# EAGLE design crz7shld (EAGLE 9.6.2)

## Sheet 1 of 2
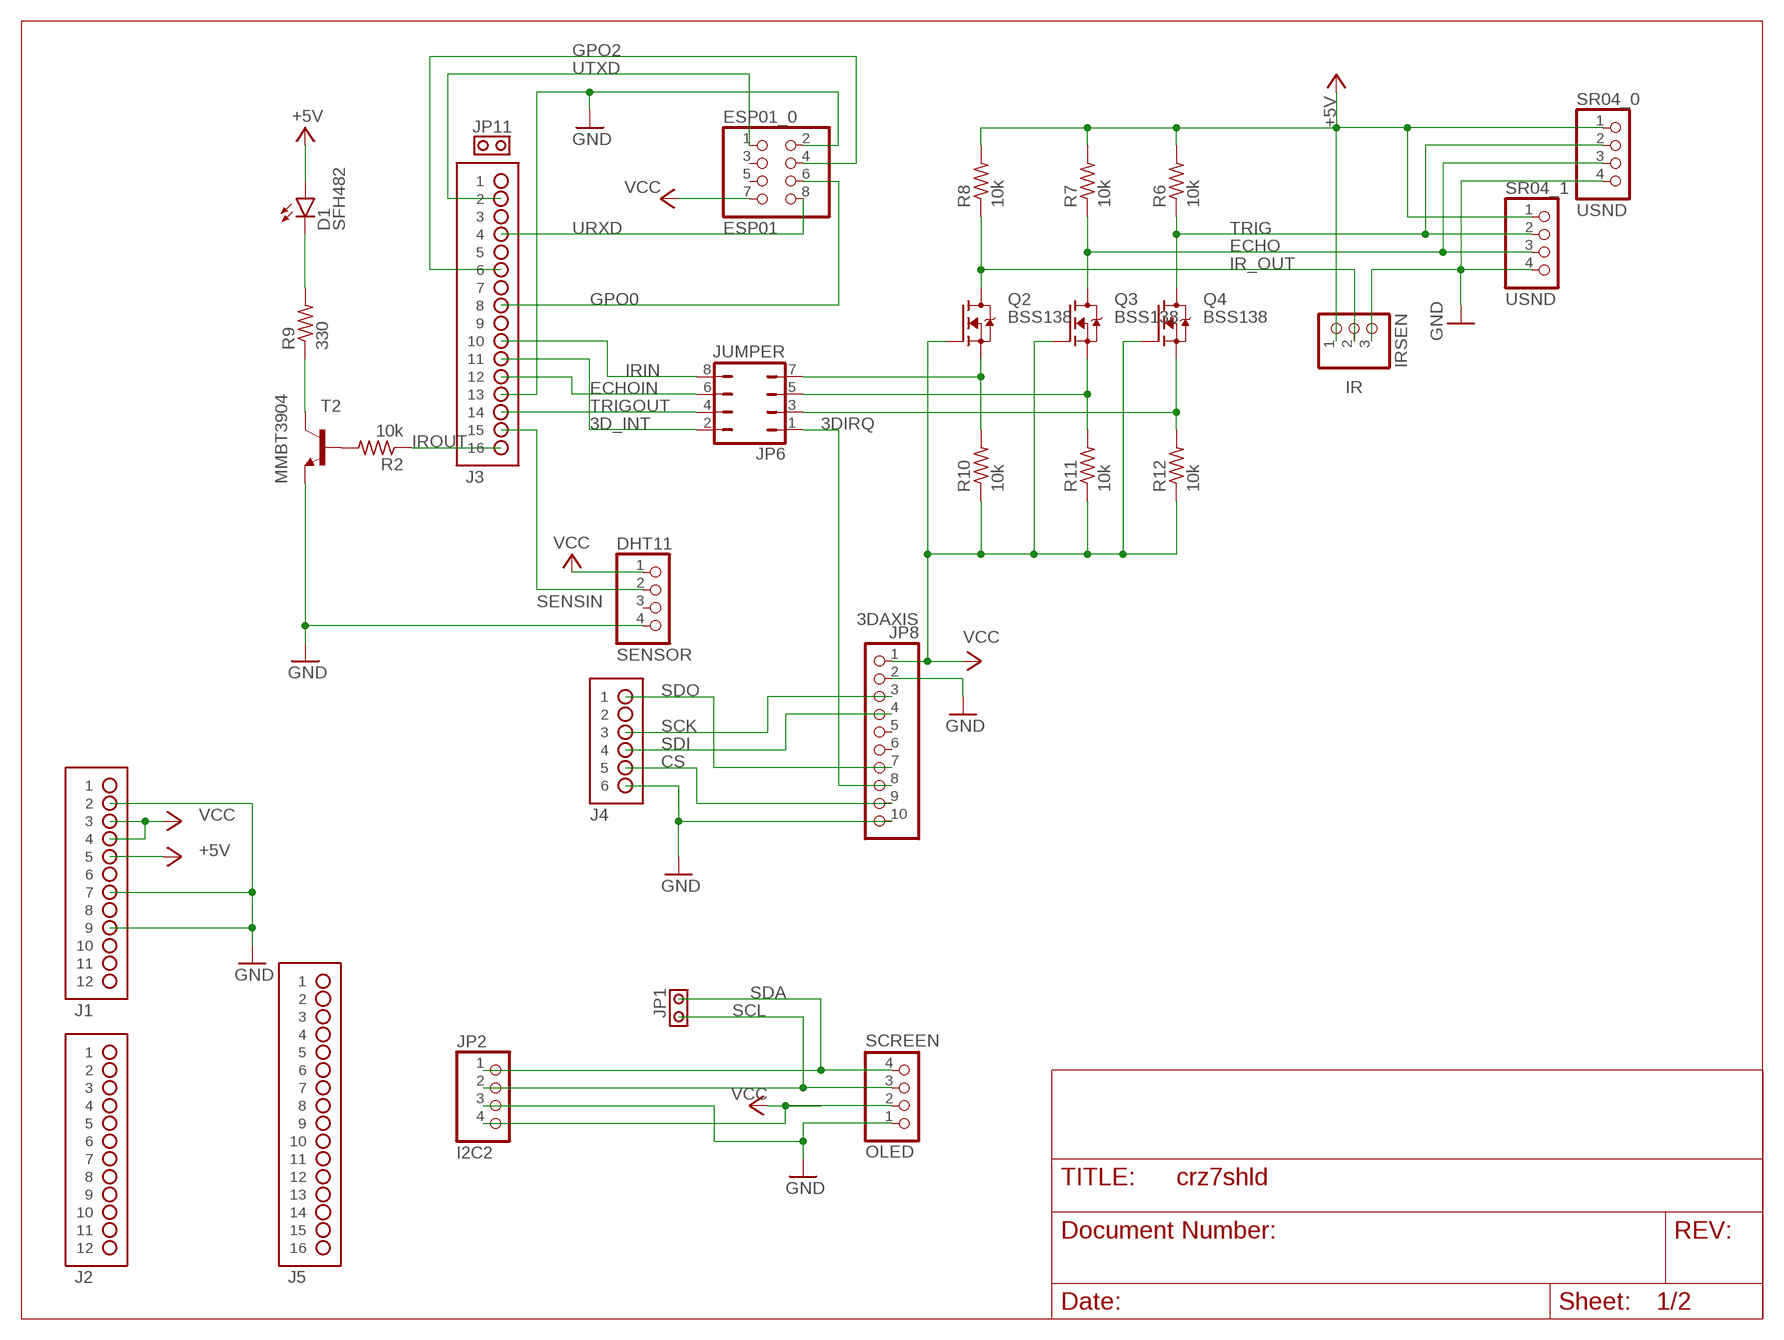
[diagram p0: schematic, sheet 1]

### Parts
D1  SFH482  [SFH482]
DHT11  SENSOR  PINHD-1X4  [1X04]
ESP01_0  ESP01  PINHD-2X4  [2X04]
IR  IRSEN  PINHD-1X3  [1X03]
J1  HDR-2X6  [HDR-2X6]
J2  HDR-2X6  [HDR-2X6]
J3  HDR-2X8  [HDR-2X8]
J4  HDR-2X3  [HDR-2X3]
J5  HDR-2X8  [HDR-2X8]
JP1  JPR-1X2  [JPR-1X2]
JP2  I2C2  PINHD-1X4  [1X04]
JP6  JUMPER  JP4Q  [JP4Q]
JP8  3DAXIS  PINHD-1X10  [1X10]
JP11  JPR-1X2  [JPR-1X2]
OLED  SCREEN  PINHD-1X4  [1X04]
Q2  BSS138  [SOT23]
Q3  BSS138  [SOT23]
Q4  BSS138  [SOT23]
R2  10k  R-US_R0402  [R0402]
R6  10k  R-US_R0402  [R0402]
R7  10k  R-US_R0402  [R0402]
R8  10k  R-US_R0402  [R0402]
R9  330  R-US_R0402  [R0402]
R10  10k  R-US_R0402  [R0402]
R11  10k  R-US_R0402  [R0402]
R12  10k  R-US_R0402  [R0402]
SR04_0  USND  PINHD-1X4  [1X04]
SR04_1  USND  PINHD-1X4  [1X04]
T2  MMBT3904  MMBT3904LT1-NPN-SOT23-BEC  [SOT23-BEC]

### Nets
3D_INT: J3.11 JP6.2
3DIRQ: JP6.1 JP8.8
+5V: D1.A IR.1 J1.5 R6.2 R7.2 R8.2 SR04_0.1 SR04_1.1
CS: J4.5 JP8.9
ECHO: Q3.3(D) R7.1 SR04_0.3 SR04_1.3
ECHOIN: J3.12 JP6.6
GND: DHT11.4 ESP01_0.2 IR.3 J1.2 J1.7 J1.9 J3.13 J4.6 JP2.3 JP8.2 JP8.10 OLED.1 SR04_0.4 SR04_1.4 T2.E
GPO0: ESP01_0.6 J3.8
GPO2: ESP01_0.4 J3.6
IR_OUT: IR.2 Q2.3(D) R8.1
IRIN: J3.10 JP6.8
IROUT: J3.16 R2.1
N$1: D1.K(C) R9.2
N$2: JP6.7 Q2.2(S) R10.2
N$3: R2.2 T2.B
N$11: JP6.5 Q3.2(S) R11.2
N$12: JP6.3 Q4.2(S) R12.2
N$17: R9.1 T2.C
SCK: J4.3 JP8.3
SCL: JP1.1 JP2.2 OLED.3
SDA: JP1.2 JP2.1 OLED.4
SDI: J4.4 JP8.4
SDO: J4.1 JP8.7
SENSIN: DHT11.2 J3.15
TRIG: Q4.3(D) R6.1 SR04_0.2 SR04_1.2
TRIGOUT: J3.14 JP6.4
URXD: ESP01_0.8 J3.4
UTXD: ESP01_0.1 J3.2
VCC: DHT11.1 ESP01_0.7 J1.3 J1.4 JP2.4 JP8.1 OLED.2 Q2.1(G) Q3.1(G) Q4.1(G) R10.1 R11.1 R12.1
Unconnected: DHT11.3 ESP01_0.3 ESP01_0.5 J1.1 J1.6 J1.8 J1.10 J1.11 J1.12 J2.1 J2.2 J2.3 J2.4 J2.5 J2.6 J2.7 J2.8 J2.9 J2.10 J2.11 J2.12 J3.1 J3.3 J3.5 J3.7 J3.9 J4.2 J5.1 J5.2 J5.3 J5.4 J5.5 J5.6 J5.7 J5.8 J5.9 J5.10 J5.11 J5.12 J5.13 J5.14 J5.15 J5.16 JP8.5 JP8.6 JP11.1 JP11.2

## Sheet 2 of 2
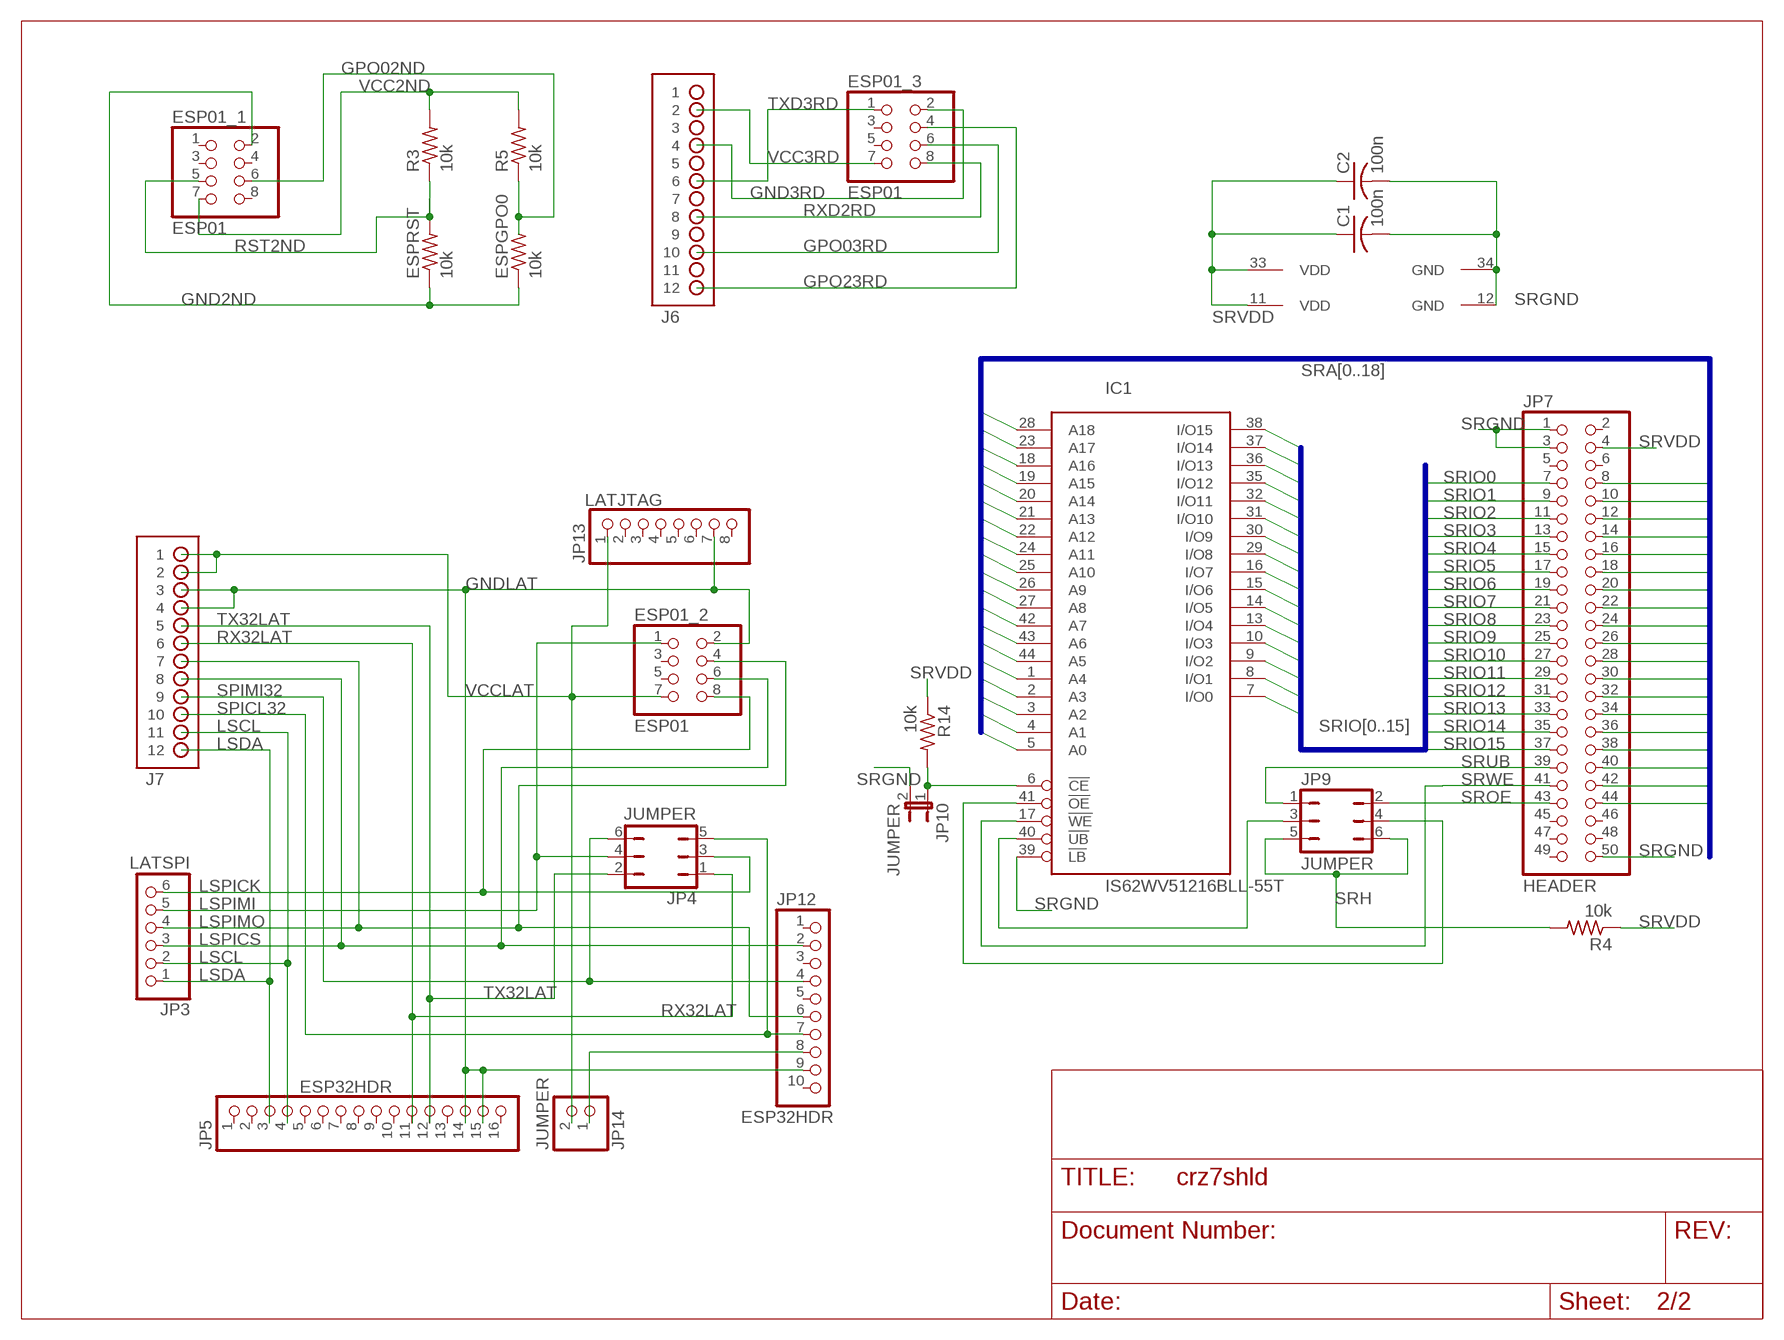
[diagram p1: schematic, sheet 2]

### Parts
C1  100n  C-USC0402  [C0402]
C2  100n  C-USC0402  [C0402]
ESP01_1  ESP01  PINHD-2X4  [2X04]
ESP01_2  ESP01  PINHD-2X4  [2X04]
ESP01_3  ESP01  PINHD-2X4  [2X04]
ESPGPO0  10k  R-US_0204/5  [0204/5]
ESPRST  10k  R-US_0204/5  [0204/5]
IC1  IS62WV51216BLL-55T  [TSOP-II-44]
J6  HDR-2X6  [HDR-2X6]
J7  HDR-2X6  [HDR-2X6]
JP3  LATSPI  PINHD-1X6  [1X06]
JP4  JUMPER  JP3Q  [JP3Q]
JP5  ESP32HDR  PINHD-1X16  [1X16]
JP7  HEADER  PINHD-2X25  [2X25]
JP9  JUMPER  JP3Q  [JP3Q]
JP10  JUMPER  JP1E  [JP1]
JP12  ESP32HDR  PINHD-1X10  [1X10]
JP13  LATJTAG  PINHD-1X8  [1X08]
JP14  JUMPER  PINHD-1X2  [1X02]
R3  10k  R-US_R0402  [R0402]
R4  10k  R-US_R0402  [R0402]
R5  10k  R-US_R0402  [R0402]
R14  10k  R-US_R0402  [R0402]

### Nets
GND2ND: ESP01_1.2 ESPGPO0.1 ESPRST.1
GND3RD: ESP01_3.2 J6.4
GNDLAT: ESP01_2.2 J7.3 J7.4 JP5.14 JP5.15 JP12.9 JP13.7
GPO02ND: ESP01_1.6 ESPGPO0.2 R5.1
GPO03RD: ESP01_3.6 J6.10
GPO23RD: ESP01_3.4 J6.12
LSCL: J7.11 JP3.2 JP5.4
LSDA: J7.12 JP3.1 JP5.3
LSPICK: ESP01_2.8 JP3.6 JP4.3
LSPICS: ESP01_2.6 J7.8 JP3.3 JP12.2
LSPIMI: ESP01_2.1 JP3.5 JP4.4
LSPIMO: ESP01_2.4 J7.7 JP3.4 JP12.6
N$4: IC1.41(!OE) JP9.4
N$5: JP12.8 JP14.1
N$7: IC1.40(!UB) JP9.3
N$20: IC1.6(!CE) JP10.1 R14.2
RST2ND: ESP01_1.5 ESPRST.2 R3.1
RX32LAT: J7.6 JP4.1 JP5.11
RXD2RD: ESP01_3.8 J6.8
SPICL32: J7.10 JP4.5 JP12.7
SPIMI32: J7.9 JP4.6 JP12.4
SRA0: IC1.5(A0) JP7.8
SRA1: IC1.4(A1) JP7.10
SRA2: IC1.3(A2) JP7.12
SRA3: IC1.2(A3) JP7.14
SRA4: IC1.1(A4) JP7.16
SRA5: IC1.44(A5) JP7.18
SRA6: IC1.43(A6) JP7.20
SRA7: IC1.42(A7) JP7.22
SRA8: IC1.27(A8) JP7.24
SRA9: IC1.26(A9) JP7.26
SRA10: IC1.25(A10) JP7.28
SRA11: IC1.24(A11) JP7.30
SRA12: IC1.22(A12) JP7.32
SRA13: IC1.21(A13) JP7.34
SRA14: IC1.20(A14) JP7.36
SRA15: IC1.19(A15) JP7.38
SRA16: IC1.18(A16) JP7.40
SRA17: IC1.23(A17) JP7.42
SRA18: IC1.28(A18) JP7.44
SRGND: C1.2 C2.2 IC1.12(GND) IC1.34(GND) IC1.39(!LB) JP7.1 JP7.3 JP7.50 JP10.2
SRH: JP9.5 JP9.6 R4.2
SRIO0: IC1.7(I/O0) JP7.7
SRIO1: IC1.8(I/O1) JP7.9
SRIO2: IC1.9(I/O2) JP7.11
SRIO3: IC1.10(I/O3) JP7.13
SRIO4: IC1.13(I/O4) JP7.15
SRIO5: IC1.14(I/O5) JP7.17
SRIO6: IC1.15(I/O6) JP7.19
SRIO7: IC1.16(I/O7) JP7.21
SRIO8: IC1.29(I/O8) JP7.23
SRIO9: IC1.30(I/O9) JP7.25
SRIO10: IC1.31(I/O10) JP7.27
SRIO11: IC1.32(I/O11) JP7.29
SRIO12: IC1.35(I/O12) JP7.31
SRIO13: IC1.36(I/O13) JP7.33
SRIO14: IC1.37(I/O14) JP7.35
SRIO15: IC1.38(I/O15) JP7.37
SROE: JP7.43 JP9.2
SRUB: JP7.39 JP9.1
SRVDD: C1.1 C2.1 IC1.11(VDD) IC1.33(VDD) JP7.4 R4.1 R14.1
SRWE: IC1.17(!WE) JP7.41
TX32LAT: J7.5 JP4.2 JP5.12
TXD3RD: ESP01_3.1 J6.6
VCC2ND: ESP01_1.7 R3.2 R5.2
VCC3RD: ESP01_3.7 J6.2
VCCLAT: ESP01_2.7 J7.1 J7.2 JP13.1 JP14.2
Unconnected: ESP01_1.1 ESP01_1.3 ESP01_1.4 ESP01_1.8 ESP01_2.3 ESP01_2.5 ESP01_3.3 ESP01_3.5 J6.1 J6.3 J6.5 J6.7 J6.9 J6.11 JP5.1 JP5.2 JP5.5 JP5.6 JP5.7 JP5.8 JP5.9 JP5.10 JP5.13 JP5.16 JP7.2 JP7.5 JP7.6 JP7.45 JP7.46 JP7.47 JP7.48 JP7.49 JP12.1 JP12.3 JP12.5 JP12.10 JP13.2 JP13.3 JP13.4 JP13.5 JP13.6 JP13.8

### Buses
SRIO[0..15]
SRA[0..18]

## Library data of the parts
C1 C2 = rcl:C-US: CAPACITOR, American symbol; SPICEPREFIX: C
D1 = led:SFH482: IR LED infrared emitting diode, Infineon
DHT11 JP2 OLED SR04_0 SR04_1 = pinhead2:PINHD-1X4: PIN HEADER
ESP01_0 ESP01_1-ESP01_3 = pinhead:PINHD-2X4: PIN HEADER
ESPGPO0 ESPRST R2-R12 R14 = rcl:R-US_: RESISTOR, American symbol; SPICEPREFIX: R
IC1 = memory-issi-asynsram:IS62WV51216BLL-*: 512k x 16 low voltage, ultra low power CMOS static RAM 55ns access time 3.6V power supply
IR = pinhead2:PINHD-1X3: PIN HEADER
J1 J2 J6 J7 = Mechanical:HDR-2X6: 2x6 header with 42mil holes and 100mil spacing
J3 J5 = Mechanical:HDR-2X8: 100mil 2x8 header
J4 = Mechanical:HDR-2X3
JP1 JP11 = Mechanical:JPR-1X2
JP3 = pinhead2:PINHD-1X6: PIN HEADER
JP4 JP9 = jumper:JP3Q: JUMPER
JP5 = pinhead2:PINHD-1X16: PIN HEADER
JP6 = jumper:JP4Q: JUMPER
JP7 = pinhead:PINHD-2X25: PIN HEADER
JP8 JP12 = pinhead2:PINHD-1X10: PIN HEADER
JP10 = jumper:JP1E: JUMPER
JP13 = pinhead2:PINHD-1X8: PIN HEADER
JP14 = pinhead2:PINHD-1X2: PIN HEADER
Q2-Q4 = bss138_10:BSS138: BSS138 N-Channel Logic Level Enhancement Mode Field Effect Transistor Source: http://www.fairchildsemi.com/datasheets/BS/BSS138.pdf; MF: Fairchild; MPN: BSS138; OC_FARNELL: 9845330; OC_NEWARK: 67R2009
T2 = transistor:*-NPN-: NPN Transistror BF959 corrected 2008.03.06

## Board
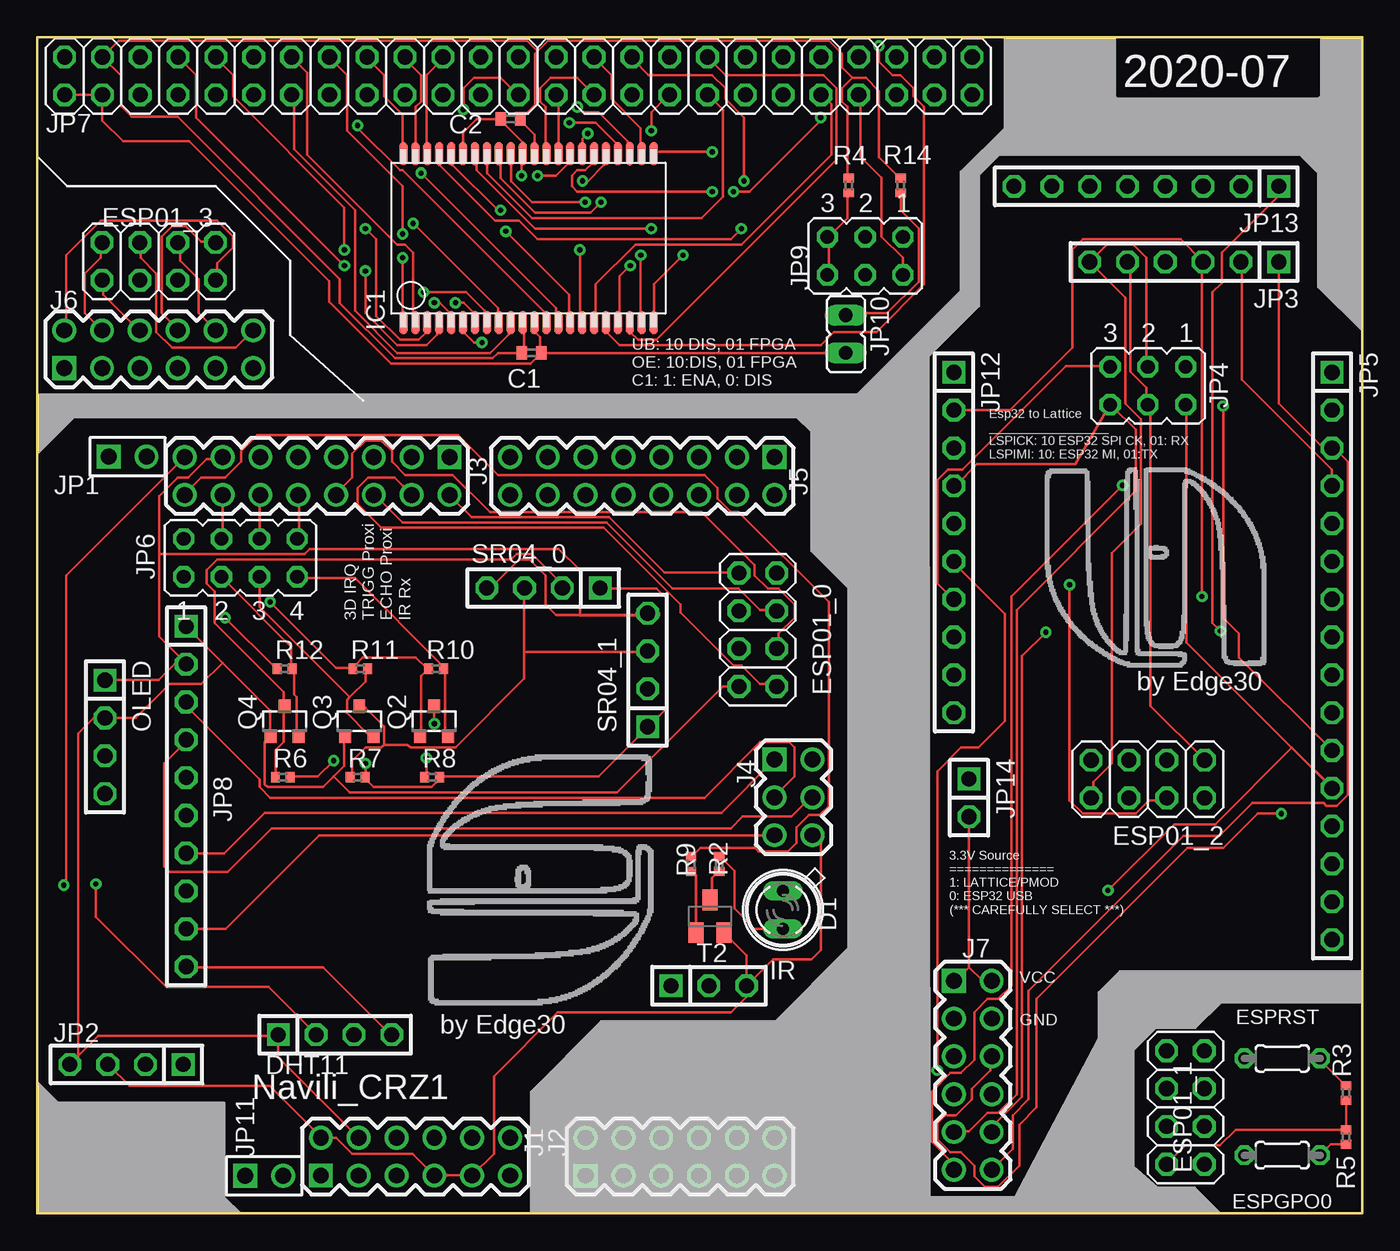
[diagram p2: board, top side]
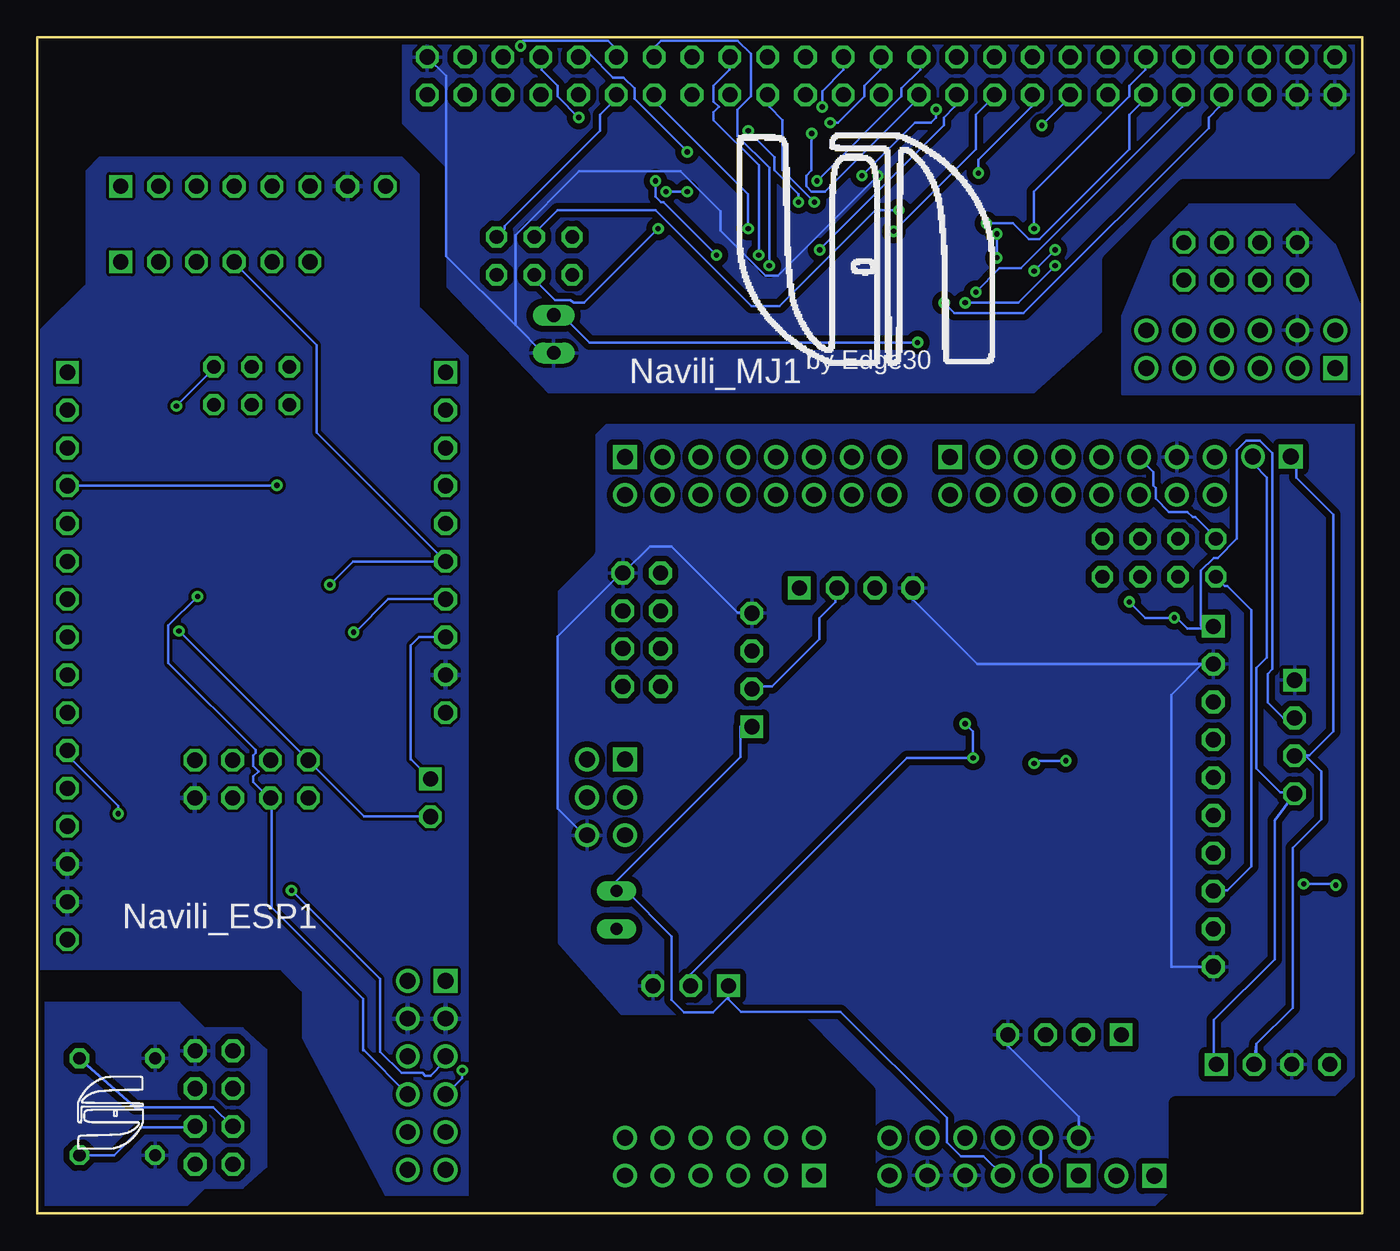
[diagram p3: board, bottom side, seen from below]

Size 89 x 79 mm. Coordinates in mm from the lower left corner, seen from the top.
Outline: 0,0 0,79 89,79 89,0 0,0
Copper layers (1*16): Top 0.035mm / dielectric 0.15mm / Bottom 0.035mm
Design rules "default *": minimum track width 6mil, minimum drill 0.35mm, track to track 8mil, track to pad 8mil, pad to pad 8mil, via to via 8mil, smd to smd 6mil, copper to edge 1mil, drill to drill 6mil, minimum pad ring 10mil, minimum via ring 8mil, stop-mask expansion 4mil, vias tented up to drill 0mil, thermal gap 10mil
tRestrict: 49 lines
bRestrict: 38 lines

### Footprints (pad centres in the part's own frame; a part is rotated, then mirrored left to right if it is on the bottom)
C0402 = smd 0.7 x 0.9: 1 -0.65,0; 2 0.65,0
SFH482 = drill 0.813 long: A -1.27,0; K 1.27,0
1X04 = drill 1.016 square: 1 -3.81,0 | drill 1.016 octagon: 2 -1.27,0; 3 1.27,0; 4 3.81,0
2X04 = drill 1.016 octagon: 1 -3.81,-1.27; 2 -3.81,1.27; 3 -1.27,-1.27; 4 -1.27,1.27; 5 1.27,-1.27; 6 1.27,1.27; 7 3.81,-1.27; 8 3.81,1.27
0204/5 = drill 0.813 octagon: 1 -2.54,0; 2 2.54,0
TSOP-II-44 = smd 0.55 x 1.6: 1 -8.4,-5.68; 2 -7.6,-5.68; 3 -6.8,-5.68; 4 -6,-5.68; 5 -5.2,-5.68; 6 -4.4,-5.68; 7 -3.6,-5.68; 8 -2.8,-5.68; 9 -2,-5.68; 10 -1.2,-5.68; 11 -0.4,-5.68; 12 0.4,-5.68; 13 1.2,-5.68; 14 2,-5.68; 15 2.8,-5.68; 16 3.6,-5.68; 17 4.4,-5.68; 18 5.2,-5.68; 19 6,-5.68; 20 6.8,-5.68; 21 7.6,-5.68; 22 8.4,-5.68; 23 8.4,5.68; 24 7.6,5.68; 25 6.8,5.68; 26 6,5.68; 27 5.2,5.68; 28 4.4,5.68; 29 3.6,5.68; 30 2.8,5.68; 31 2,5.68; 32 1.2,5.68; 33 0.4,5.68; 34 -0.4,5.68; 35 -1.2,5.68; 36 -2,5.68; 37 -2.8,5.68; 38 -3.6,5.68; 39 -4.4,5.68; 40 -5.2,5.68; 41 -6,5.68; 42 -6.8,5.68; 43 -7.6,5.68; 44 -8.4,5.68
1X03 = drill 1.016 square: 1 -2.54,0 | drill 1.016 octagon: 2 0,0; 3 2.54,0
HDR-2X6 = drill 1.067 square: 1 -1.27,6.35 | drill 1.067: 2 1.27,6.35; 3 -1.27,3.81; 4 1.27,3.81; 5 -1.27,1.27; 6 1.27,1.27; 7 -1.27,-1.27; 8 1.27,-1.27; 9 -1.27,-3.81; 10 1.27,-3.81; 11 -1.27,-6.35; 12 1.27,-6.35
HDR-2X8 = drill 1.067 square: 1 -1.27,8.89 | drill 1.067: 2 1.27,8.89; 3 -1.27,6.35; 4 1.27,6.35; 5 -1.27,3.81; 6 1.27,3.81; 7 -1.27,1.27; 8 1.27,1.27; 9 -1.27,-1.27; 10 1.27,-1.27; 11 -1.27,-3.81; 12 1.27,-3.81; 13 -1.27,-6.35; 14 1.27,-6.35; 15 -1.27,-8.89; 16 1.27,-8.89
HDR-2X3 = drill 1.067 square: 1 -1.27,2.54 | drill 1.067: 2 1.27,2.54; 3 -1.27,0; 4 1.27,0; 5 -1.27,-2.54; 6 1.27,-2.54
JPR-1X2 = drill 1.067 square: 1 0,1.27 | drill 1.067: 2 0,-1.27
1X06 = drill 1.016 square: 1 -6.35,0 | drill 1.016 octagon: 2 -3.81,0; 3 -1.27,0; 4 1.27,0; 5 3.81,0; 6 6.35,0
JP3Q = drill 0.914 octagon: 1 -2.54,-1.27; 2 -2.54,1.27; 3 0,-1.27; 4 0,1.27; 5 2.54,-1.27; 6 2.54,1.27
1X16 = drill 1.016 square: 1 -19.05,0 | drill 1.016 octagon: 2 -16.51,0; 3 -13.97,0; 4 -11.43,0; 5 -8.89,0; 6 -6.35,0; 7 -3.81,0; 8 -1.27,0; 9 1.27,0; 10 3.81,0; 11 6.35,0; 12 8.89,0; 13 11.43,0; 14 13.97,0; 15 16.51,0; 16 19.05,0
JP4Q = drill 0.914 octagon: 1 -3.81,-1.27; 2 -3.81,1.27; 3 -1.27,-1.27; 4 -1.27,1.27; 5 1.27,-1.27; 6 1.27,1.27; 7 3.81,-1.27; 8 3.81,1.27
2X25 = drill 1.016 octagon: 1 -30.48,-1.27; 2 -30.48,1.27; 3 -27.94,-1.27; 4 -27.94,1.27; 5 -25.4,-1.27; 6 -25.4,1.27; 7 -22.86,-1.27; 8 -22.86,1.27; 9 -20.32,-1.27; 10 -20.32,1.27; 11 -17.78,-1.27; 12 -17.78,1.27; 13 -15.24,-1.27; 14 -15.24,1.27; 15 -12.7,-1.27; 16 -12.7,1.27; 17 -10.16,-1.27; 18 -10.16,1.27; 19 -7.62,-1.27; 20 -7.62,1.27; 21 -5.08,-1.27; 22 -5.08,1.27; 23 -2.54,-1.27; 24 -2.54,1.27; 25 0,-1.27; 26 0,1.27; 27 2.54,-1.27; 28 2.54,1.27; 29 5.08,-1.27; 30 5.08,1.27; 31 7.62,-1.27; 32 7.62,1.27; 33 10.16,-1.27; 34 10.16,1.27; 35 12.7,-1.27; 36 12.7,1.27; 37 15.24,-1.27; 38 15.24,1.27; 39 17.78,-1.27; 40 17.78,1.27; 41 20.32,-1.27; 42 20.32,1.27; 43 22.86,-1.27; 44 22.86,1.27; 45 25.4,-1.27; 46 25.4,1.27; 47 27.94,-1.27; 48 27.94,1.27; 49 30.48,-1.27; 50 30.48,1.27
1X10 = drill 1.016 square: 1 -11.43,0 | drill 1.016 octagon: 2 -8.89,0; 3 -6.35,0; 4 -3.81,0; 5 -1.27,0; 6 1.27,0; 7 3.81,0; 8 6.35,0; 9 8.89,0; 10 11.43,0
JP1 = drill 0.914 long: 1 0,-1.27; 2 0,1.27
1X08 = drill 1.016 square: 1 -8.89,0 | drill 1.016 octagon: 2 -6.35,0; 3 -3.81,0; 4 -1.27,0; 5 1.27,0; 6 3.81,0; 7 6.35,0; 8 8.89,0
1X02 = drill 1.016 square: 1 -1.27,0 | drill 1.016 octagon: 2 1.27,0
SOT23 = smd 0.8 x 0.9: 1 -0.95,-1; 2 0.95,-1; 3 0,1
R0402 = smd 0.6 x 0.7: 1 -0.5,0; 2 0.5,0
SOT23-BEC = smd 1 x 1.4: B -0.95,-1.1; C 0,1.1; E 0.95,-1.1

### Placement (x,y rotation side)
C1  33.2,57.8 0 top
C2  31.8,73.5 180 top
D1  50.09,20.39 270 top
DHT11  20,12 0 top
ESP01_0  48.4,39.2 270 top
ESP01_1  77.12,7.11 270 top
ESP01_2  74.6,29.17 180 top
ESP01_3  8.16,63.94 0 top
ESPGPO0  83.62,3.91 0 top
ESPRST  83.62,10.41 0 top
IC1  33,65.5 0 top
IR  45.11,15.29 0 top
J1  25.4,3.81 90 top
J2  43.18,3.81 90 top
J3  18.8,49.53 270 top
J4  50.8,27.94 0 top
J5  40.64,49.53 270 top
J6  8.16,58.04 90 top
J7  62.84,9.27 0 top
JP1  6.07,50.83 90 top
JP2  6,10 180 top
JP3  77.04,63.91 180 top
JP4  74.6,55.59 180 top
JP5  86.97,37.44 270 top
JP6  13.65,44.03 0 top
JP7  32.32,76.4 0 top
JP8  10,28 270 top
JP9  55.61,64.31 180 top
JP10  54.31,59.06 180 top
JP11  15.24,2.51 90 top
JP12  61.57,45.06 270 top
JP13  74.5,68.99 180 top
JP14  62.59,27.91 270 top
OLED  4.55,32 270 top
Q2  26.65,33.06 0 top
Q3  21.64,33.06 0 top
Q4  16.62,33.06 0 top
R2  43.91,23.46 270 top
R3  87.91,8.08 270 top
R4  54.5,69.04 270 top
R5  87.92,5.12 90 top
R6  16.5,29.29 0 top
R7  21.51,29.29 0 top
R8  26.53,29.29 0 top
R9  45.81,23.46 90 top
R10  26.78,36.58 0 top
R11  21.7,36.58 0 top
R12  16.62,36.58 0 top
R14  58,69.04 270 top
SR04_0  34,42 180 top
SR04_1  41,36.5 90 top
T2  45.19,19.95 0 top

### Tracks (layer width: path | path; a pad name or v marks a point on that pad's centre or on a via)
3D_INT
  Bottom 0.152: JP6.2 9.96,45.34 10.31,45.7 10.31,45.87 11.2,46.76 11.38,46.76 11.73,47.12 12.98,47.12 13.87,48.01 13.87,48.72 14.05,48.9 14.05,49.78 14.94,50.67 J3.11
3DIRQ
  Bottom 0.152: JP6.1 9.78,42.67 9.25,42.14 9.07,42.14 7.47,40.54 7.47,23.29 9.07,21.69 9.96,21.69 JP8.8
+5V  (via drill 0.35)
  Top 0.152: v19.91,30.4 18.85,29.34 17.07,29.34 R6.2 | v22.05,30.23 22.05,29.34 R7.2 22.05,29.16 22.58,28.63 26.49,28.63 27.03,29.16 R8.2 27.2,29.34 37.69,29.34 40.89,32.54 SR04_1.1 41.07,32.72 42.32,33.96 42.32,41.25 41.6,41.96 37.87,41.96 SR04_0.1
  Bottom 0.152: v19.91,30.4 21.87,30.4 v22.05,30.23 | SR04_1.1 41.76,32.69 41.76,30.65 50.75,21.66 D1.A 49.43,21.66 46.38,18.61 46.38,14.32 45.54,13.49 43.61,13.49 42.57,14.53 | 42.57,14.53 42.57,14.37 41.73,13.54 35.04,13.54 27.9,6.4 27.9,4.79 26.96,3.85 25.44,3.85 J1.5 | IR.1 42.57,14.53
CS
  Top 0.152: J4.5 18.95,25.4 12.66,19.11 JP8.9
ECHO
  Top 0.152: 23.29,31.47 23.11,31.29 22.05,31.29 21.16,30.4 21.16,29.34 R7.1 | 23.29,31.47 23.29,32.72 22.05,33.96 21.69,33.96 Q3.3 | 23.29,31.47 24.89,31.47 25.07,31.29 28.09,31.29 32.72,35.92 32.72,37.69 | 32.72,37.69 32.72,41.96 SR04_0.3 | 32.72,37.69 40.89,37.69 SR04_1.3
ECHOIN
  Top 0.152: JP6.6 14.94,45.34 14.94,48.18 J3.12
GND
  Top 0.152: 40.11,40.18 40.89,40.18 SR04_1.4 | 36.45,40.18 34.85,40.18 34.14,40.89 34.14,42.85 33.07,43.92 32.36,43.92 30.58,42.14 30.23,42.14 SR04_0.4 | 8.18,44.27 8.18,38.76 9.96,36.98 JP8.2 9.24,36.89 8.16,35.81 OLED.1 | 8.18,44.27 8.18,48.18 9.42,49.43 10.13,49.43 11.38,50.67 12.45,50.67 J3.13 | 36.45,40.18 36.45,43.2 35.03,44.63 18.31,44.63 17.96,44.27 8.18,44.27 | JP2.3 4.8,9.96 6.2,8.56 15.62,8.56 19.02,5.16 J1.2 20.06,5.08 21.14,4 25.21,4 J1.7 J1.9 30.67,4 30.67,9.2 34.96,13.49 46.61,13.49 47.65,14.53 IR.3 | JP8.10 10.13,16.54 19.2,16.54 23.65,12.09 DHT11.4 | 36.45,40.18 40.11,40.18 | 40.11,40.18 40.24,40.31 SR04_1.4 | IR.3 49.43,17.07 52.01,17.07 52.63,17.69 52.63,24.89 52.12,25.4 J4.6 | T2.E 47.65,17.34 IR.3 | 36.45,40.18 36.46,40.17 41.76,40.17 41.76,40.31 SR04_1.4
  Bottom 0.152: SR04_1.4 41.07,40.36 41.96,40.36 46.41,44.81 47.83,44.81 49.61,43.03 ESP01_0.2 49.78,42.85 49.96,42.85 54.05,38.76 54.05,27.2 52.09,25.25 J4.6 | SR04_0.4 30.19,41.24 25.84,36.89 10.76,36.89 | DHT11.4 23.81,11.24 19.05,6.48 J1.2 | JP8.2 10.76,36.89 | 10.76,36.89 12.84,34.81 12.84,16.57 JP8.10
  pour Bottom (isolate 0.406): 0,53.34 50.8,53.34 52.07,52.07 52.07,44.45 54.61,41.91 54.61,17.98 49.53,12.9 37.78,12.8 33.25,8.27 33.16,8.27 33.16,0 13.68,0 12.59,1.09 12.59,7.39 1.47,7.39 0,8.86 0,51.03
GND2ND
  pour Bottom (isolate 0.406): 89,0 79.48,0 77.76,1.71 75.21,1.71 73.62,3.14 73.62,11 75.21,12.42 77.76,12.42 79.48,14.14 89,14.14
GND3RD
  Top 0.152: ESP01_3.2 4.27,65.08 4.27,64.19 3.2,63.12 3.2,60.45 4.27,59.38 J6.4
  pour Bottom: 16.13,55.04 16.13,60.27 14.05,65.3 11.61,67.74 4.52,67.74 1.86,65.08 0.13,60.89 0.13,55.04
GNDLAT
  pour Bottom: 64.5,71.08 84.82,71.08 85.86,70.04 85.86,62.42 88.9,59.38 88.9,16.31 72.75,16.31 71.3,14.85 71.3,11.73 65.7,1.09 59.92,1.08 59.92,57.61 63.23,60.92 63.23,69.81
GPO0
  Top 0.152: ESP01_0.6 49.78,38.05 49.78,38.94 50.85,40.01 50.85,40.89 49.78,41.96 49.07,41.96 48.18,42.85 48.18,43.56 44.63,47.12 30.4,47.12 27.91,49.61 24.71,49.61 23.82,50.49 23.82,51.21 23.11,51.92 22.05,51.92 21.16,51.03 21.16,49.43 20.09,48.36 J3.8
GPO2
  Top 0.152: ESP01_0.4 49.61,40.54 48.54,40.54 47.12,41.96 42.67,41.96 38.23,46.41 24.54,46.41 22.76,48.18 J3.6
GPO02ND
  Top 0.152: R5.1 86.88,4.62 ESPGPO0.2
  Bottom 0.152: ESPGPO0.2 86.06,3.91 83.83,3.91 81.97,5.78 78.4,5.78 ESP01_1.6
GPO03RD
  Top 0.152: ESP01_3.6 9.6,65.08 9.6,64.01 10.85,62.76 10.85,60.45 11.91,59.38 J6.10
GPO23RD
  Top 0.152: ESP01_3.4 6.93,65.08 6.93,64.19 8,63.12 8,59.21 9.07,58.14 13.34,58.14 14.4,59.21 J6.12
IR_OUT  (via drill 0.35)
  Top 0.152: v26.14,30.58 26.14,29.34 R8.1 | v26.67,32.89 26.67,33.96 Q2.3
  Bottom 0.152: v26.67,32.89 26.14,32.36 v26.14,30.58 30.58,30.58 45.11,16.05 IR.2
IRIN
  Top 0.152: JP6.8 17.6,45.34 17.6,48.18 J3.10
IROUT
  Top 0.152: J3.16 9.96,48.36 11.02,49.43 12.62,49.43 13.69,50.49 13.69,51.21 14.76,52.27 28.27,52.27 30.94,49.61 44.81,49.61 45.7,48.72 45.7,48.01 46.58,47.12 47.12,47.12 53.16,41.07 53.16,27.38 52.54,26.76 51.83,26.76 50.99,25.92 50.99,24.89 50.42,24.32 48.43,24.32 48.21,24.54 44.54,24.54 43.96,23.96 R2.1
LSCL  (via drill 0.35)
  Top 0.152: JP5.4 86.94,48.9 86.94,49.96 80.9,56.01 80.9,63.83 JP3.2 | v72.9,48.9 65.43,41.43 65.43,15.29 64.54,14.4 63.83,14.4 62.94,13.51 62.94,10.31 62.05,9.42 61.34,9.42 60.1,8.18 60.1,4.8 61.52,3.38 61.52,3.02 J7.11
  Bottom 0.152: v72.9,48.9 86.94,48.9 JP5.4
LSDA
  Top 0.152: JP3.1 83.39,54.41 86.39,51.41 JP5.3 87.12,51.38 88.01,50.49 88.01,28.09 87.3,27.38 86.59,27.38 86.41,27.56 81.61,27.56 79.39,25.34 76.99,25.34 66.59,14.94 66.59,7.64 65.52,6.58 65.52,4.33 J7.12
LSPICK
  Top 0.152: JP4.3 74.5,56.9 74.5,64.19 73.61,65.08 71.83,65.08 70.76,64.01 JP3.6 73.08,61.52 73.08,54.41 74.14,53.34 74.14,46.32 72.19,44.36 72.19,30.23 70.94,28.98 70.94,27.91 ESP01_2.8
LSPICS  (via drill 0.35)
  Top 0.152: JP12.2 65.33,53.95 69.52,58.14 69.52,64.72 70.23,65.43 76.81,65.43 78.23,64.01 JP3.3 78.23,63.83 v78.23,41.43
  Bottom 0.152: v78.23,41.43 80.19,39.47 80.19,36.98 74.32,31.11 74.32,30.94 74.5,30.76 74.5,30.05 74.14,29.69 74.5,29.34 74.5,28.98 73.43,27.91 ESP01_2.6 73.25,27.74 73.25,20.54 67.12,14.4 67.12,10.94 67.04,10.94 J7.8
LSPIMI
  Top 0.152: JP3.5 73.25,63.83 73.43,63.65 73.43,56.54 74.5,55.47 74.5,54.41 JP4.4 74.77,54.13 74.77,34.09 ESP01_2.1
LSPIMO  (via drill 0.35)
  Top 0.152: v69.34,42.23 69.34,27.74 70.23,26.85 73.79,26.85 74.68,27.74 75.74,27.74 ESP01_2.4 | v60.45,9.6 60.45,29.69 62.05,31.29 63.21,31.29 64.99,33.07 64.99,40.27 61.57,43.69 JP12.6
  Bottom 0.152: v69.34,42.23 67.78,43.79 JP12.6 70.23,52.45 70.23,58.32 75.74,63.83 JP3.4 | v60.45,9.6 60.45,9.07 61.52,8 J7.7
N$1
  Top 0.152: R9.2 45.86,23.96 46.82,23 46.82,20.48 48.19,19.12 D1.K
N$2
  Top 0.152: Q2.2 27.56,32.18 27.38,32.36 27.38,36.45 R10.2 27.2,36.63 27.2,36.8 21.34,42.67 17.6,42.67 JP6.7
N$3
  Top 0.152: R2.2 43.96,22.96 44.24,22.69 T2.B
N$4  (via drill 0.35)
  Top 0.152: v47.3,66.14 46.58,65.43 33.6,65.43 32.36,66.67 30.76,66.67 27.03,70.41 27.03,71.12 IC1.41
  Bottom 0.152: v47.3,66.14 52.27,61.16 52.98,61.16 53.16,61.34 54.23,61.34 55.47,62.59 55.47,62.94 JP9.4
N$5
  Bottom 0.152: JP12.8 63.35,38.71 63.92,38.14 63.92,30.49 63.89,30.49 JP14.1
N$7  (via drill 0.35)
  Top 0.152: v31.11,67.39 30.94,67.39 27.91,70.41 27.91,71.12 IC1.40
  Bottom 0.152: v31.11,67.39 32.72,67.39 39.16,60.94 41.03,60.94 47.47,67.39 54.05,67.39 55.47,65.96 55.47,65.61 JP9.3
N$11
  Top 0.152: 20.98,34.67 20.8,34.49 20.8,33.6 22.23,32.18 22.58,32.18 Q3.2 | 20.98,34.67 22.05,35.74 22.05,36.45 R11.2 | 20.98,34.67 14.94,40.72 14.94,42.67 JP6.5
N$12
  Top 0.152: Q4.2 17.42,32.18 17.42,34.67 17.25,34.85 17.25,36.45 R12.2 17.07,36.63 17.07,38.05 12.45,42.67 JP6.3
N$17
  Top 0.152: R9.1 45.76,22.96 45.34,22.54 45.34,21.07 T2.C
N$20  (via drill 0.35)
  Top 0.152: JP10.1 54.41,60.45 57.07,60.45 59.21,62.59 59.21,66.14 58,67.35 R14.2 | v29.87,58.5 29.34,58.5 28.63,59.21 28.63,59.74 IC1.6
  Bottom 0.152: v29.87,58.5 51.92,58.5 53.7,60.27 54.23,60.27 JP10.1
RST2ND
  Top 0.152: R3.1 87.86,8.59 86.16,10.28 ESPRST.2
  Bottom 0.152: ESPRST.2 82.41,7.11 77.17,7.11 75.92,5.87 ESP01_1.5
RX32LAT  (via drill 0.35)
  Top 0.152: v79.65,54.23 79.65,40.01 80.72,38.94 80.72,37.34 JP5.11 | J7.6 64.01,10.49 64.01,9.6 62.76,8.36 62.76,7.64 61.7,6.58 60.98,6.58 60.45,6.04 60.45,4.98 61.34,4.09 62.05,4.09 62.94,3.2 62.94,2.49 63.65,1.78 64.54,1.78 65.96,3.2 65.96,5.96 67.12,7.11 67.12,14.4 77.25,24.54 79.65,24.54 81.97,26.85 v83.57,26.85
  Bottom 0.152: v79.65,54.23 77.17,56.72 JP4.1 | v83.57,26.85 83.57,27.38 87.12,30.94 JP5.11
RXD2RD
  Top 0.152: ESP01_3.8 11.91,65.25 11.02,65.25 9.96,66.32 9.07,66.32 8.36,65.61 8.36,60.45 9.42,59.38 J6.8
SCK
  Top 0.152: JP8.3 10.13,34.31 10.13,33.96 14.94,29.16 14.94,28.63 15.65,27.91 44.81,27.91 48.54,31.65 50.49,31.65 50.85,31.29 50.85,29.34 49.61,28.09 J4.3
SCL
  Bottom 0.152: 3.91,30.76 3.56,30.76 1.96,32.36 1.96,46.94 4.45,49.43 4.45,50.32 4.8,50.67 JP1.1 | 3.91,30.76 4.45,30.76 OLED.3 | 7.11,11.38 7.11,10.13 JP2.2 7.11,11.38 | 3.91,30.76 OLED.3 | OLED.3 3.79,30.73 2.75,29.69 2.75,26.47 4.68,24.54 4.68,13.81 7.11,11.38
SDA
  Bottom 0.152: JP2.1 9.96,10.13 9.96,13.01 5.89,17.07 5.89,26.39 OLED.4 4.62,28.27 5.51,28.27 7.11,29.87 7.11,36.63 6.4,37.34 6.4,49.43 7.29,50.32 7.29,50.67 JP1.2
SDI
  Top 0.152: JP8.4 9.96,31.65 8.53,30.23 8.53,23.29 8.89,22.94 12.8,22.94 15.73,25.87 46.58,25.87 47.38,26.67 50.67,26.67 51.92,27.91 J4.4
SDO
  Top 0.152: J4.1 45.96,26.91 15.27,26.91 12.54,24.19 JP8.7
SENSIN  (via drill 0.35)
  Top 0.152: v1.78,22.05 1.96,22.23 1.96,42.85 J3.15 | DHT11.2 18.67,12.09 15.56,15.2 8.65,15.2 3.94,19.92 v3.94,22.14
  Bottom 0.152: v3.94,22.14 1.87,22.14 v1.78,22.05
SPICL32  (via drill 0.35)
  Top 0.152: JP4.5 72.02,56.9 69.08,56.9 62.14,49.96 61.16,49.96 60.45,49.25 60.45,42.32 61.52,41.25 JP12.7 | v67.74,39.03 66.14,37.43 66.14,7.82 64.19,5.87 64.19,5.51 J7.10
  Bottom 0.152: v67.74,39.03 67.65,39.03 65.43,41.25 JP12.7
SPIMI32
  Top 0.152: JP12.4 61.7,48.9 63.12,50.32 69.72,50.32 JP4.6 72.19,54.23 73.79,52.63 73.79,48.54 65.79,40.54 65.79,8 64.54,6.76 63.83,6.76 62.59,5.51 61.7,5.51 J7.9
SRA0  (via drill 0.35)
  Top 0.152: v26.67,61.16 27.03,61.16 27.74,60.45 27.74,59.92 IC1.5 | v20.62,63.65 10.67,73.61 10.67,76.45 9.6,77.52 JP7.8
  Bottom 0.152: v26.67,61.16 23.11,61.16 v20.62,63.65
SRA1  (via drill 0.35)
  Top 0.152: v22.05,63.3 22.05,60.45 24.18,58.32 26.14,58.32 26.85,59.03 26.85,59.74 IC1.4 | v20.62,64.72 20.62,67.56 13.16,75.03 13.16,76.45 12.09,77.52 JP7.10
  Bottom 0.152: v20.62,64.72 v22.05,63.3
SRA2  (via drill 0.35)
  Top 0.152: v22.05,66.14 22.76,65.43 22.76,60.27 24.36,58.67 25.6,58.67 26.14,59.21 26.14,59.74 IC1.3
  Bottom 0.152: v22.05,66.14 22.05,68.63 15.65,75.03 15.65,75.74 14.58,76.81 14.58,77.52 JP7.12
SRA3
  Top 0.152: IC1.2 25.25,59.92 25.25,64.54 24.71,65.08 24.18,65.08 18.14,71.12 18.14,76.63 17.25,77.52 JP7.14
SRA4  (via drill 0.35)
  Top 0.152: v24.54,64.19 24.54,59.92 IC1.1 | v24.54,65.79 24.54,68.99 20.8,72.72 20.8,76.45 19.74,77.52 JP7.16
  Bottom 0.152: v24.54,65.79 v24.54,64.19
SRA5
  Top 0.152: IC1.44 24.54,71.3 24.54,73.79 23.29,75.03 23.29,76.45 22.23,77.52 JP7.18
SRA6
  Top 0.152: IC1.43 25.43,71.3 25.43,74.32 25.78,74.68 25.78,76.45 24.71,77.52 JP7.20
SRA7
  Top 0.152: IC1.42 26.14,71.3 26.14,76.45 27.2,77.52 JP7.22
SRA8  (via drill 0.35)
  Top 0.152: v36.63,69.34 36.98,69.34 38.05,70.41 38.05,71.12 IC1.27
  Bottom 0.152: v36.63,69.34 30.94,75.03 30.94,75.56 29.69,76.81 29.69,77.52 JP7.24
SRA9  (via drill 0.35)
  Top 0.152: v35.74,73.25 37.52,73.25 38.94,71.83 38.94,71.3 IC1.26
  Bottom 0.152: v35.74,73.25 35.2,73.25 33.43,75.03 33.43,75.74 32.36,76.81 32.36,77.52 JP7.26
SRA10  (via drill 0.35)
  Top 0.152: v36.27,74.32 36.63,73.97 37.69,73.97 39.65,72.01 39.65,71.3 IC1.25
  Bottom 0.152: v36.27,74.32 36.27,75.39 34.85,76.81 34.85,77.52 JP7.28
SRA11
  Top 0.152: IC1.24 40.54,71.3 40.54,72.9 38.58,74.85 38.58,76.45 37.52,77.52 JP7.30
SRA12  (via drill 0.35)
  Top 0.152: v43.38,64.36 41.43,62.41 41.43,59.92 IC1.22 | v47.47,69.34 47.47,73.61 46.23,74.85 46.23,75.56 45.34,76.45 41.07,76.45 40.01,77.52 JP7.32
  Bottom 0.152: v43.38,64.36 46.94,67.92 47.12,67.92 47.47,68.28 v47.47,69.34
SRA13  (via drill 0.35)
  Top 0.152: v40.54,64.36 40.54,59.92 IC1.21
  Bottom 0.152: v40.54,64.36 40.54,70.41 43.56,73.43 43.56,73.97 43.2,74.32 43.56,74.68 43.56,75.74 42.49,76.81 42.49,77.52 JP7.34
SRA14
  Top 0.152: IC1.20 39.83,59.74 39.83,59.21 40.36,58.67 41.6,58.67 53.7,70.76 53.7,75.56 52.81,76.45 46.23,76.45 45.16,77.52 JP7.36
SRA15  (via drill 0.35)
  Top 0.152: v39.83,63.65 39.12,62.94 39.12,59.92 IC1.19
  Bottom 0.152: v39.83,63.65 39.83,70.23 41.96,72.36 41.96,74.14 41.07,75.03 41.07,77.88 41.96,78.77 47.12,78.77 47.47,78.41 47.47,77.7 JP7.38
SRA16  (via drill 0.35)
  Top 0.152: v56.54,78.41 56.54,77.34 57.43,76.45 57.96,76.45 58.85,75.56 58.85,75.03 59.56,74.32 59.56,62.41 56.36,59.21 53.52,59.21 52.63,58.32 39.12,58.32 38.23,59.21 38.23,59.74 IC1.18
  Bottom 0.152: v56.54,78.41 56.54,78.59 56.36,78.77 50.67,78.77 50.14,78.23 50.14,77.7 JP7.40
SRA17  (via drill 0.35)
  Top 0.152: v45.34,71.3 41.43,71.3 IC1.23
  Bottom 0.152: v45.34,71.3 48.9,74.85 48.9,75.56 49.61,76.28 50.32,76.28 51.92,77.88 52.45,77.88 52.63,77.7 JP7.42
SRA18  (via drill 0.35)
  Top 0.152: v45.34,68.63 36.27,68.63 35.92,68.99 35.92,69.7 36.27,70.05 36.8,70.05 37.34,70.59 37.34,71.12 IC1.28 | v46.76,68.63 47.83,68.63 52.63,73.43 v52.63,73.61
  Bottom 0.152: v46.76,68.63 v45.34,68.63 | v52.63,73.61 54.05,75.03 54.05,75.74 55.12,76.81 55.12,77.52 JP7.44
SRGND  (via drill 0.35)
  Top 0.152: IC1.39 28.63,71.3 28.63,71.83 IC1.39 | C1.2 33.78,57.96 33.78,58.85 33.43,59.21 33.43,59.74 IC1.12 | C1.2 33.96,57.78 54.23,57.78 JP10.2 | v32.54,69.7 32.54,71.12 IC1.34 32.6,71.95 31.15,73.4 C2.2 29.5,73.5 28.6,72.6 IC1.39 | JP7.1 JP7.3 4.38,73.41 5.78,72.01 10.22,72.01 19.6,62.63 19.6,61.23 23.76,57.07 33.12,57.07 C1.2
  Bottom 0.152: JP7.50 61.53,76.4 61.53,64.3 56.88,59.65 | v32.54,69.7 39.24,62.99 40.1,62.99 43.1,66 43.1,67.33 45.78,70 52.59,70 56.88,65.71 56.88,59.65 | 56.88,59.65 55.02,57.79 JP10.2
  pour Bottom (isolate 0.406): 0,79 65,79 65,73 62,70 62,62 54.5,54.5 22.62,54.5 17,59 17,64 12,69 2,69 0,71
SRH
  Top 0.152: R4.2 54.41,68.45 54.41,66.85 53.16,65.61 JP9.5 53.16,65.43 53.16,63.12 JP9.6
SRIO0  (via drill 0.35)
  Top 0.152: v28.09,61.16 28.63,61.16 29.34,60.45 29.34,59.92 IC1.7
  Bottom 0.152: v28.09,61.16 27.38,60.45 22.76,60.45 10.31,72.9 10.31,73.61 9.6,74.32 9.6,75.03 JP7.7
SRIO1  (via drill 0.35)
  Top 0.152: v25.96,61.87 28.8,61.87 30.05,60.63 30.05,59.92 IC1.8
  Bottom 0.152: v25.96,61.87 24.36,63.48 22.94,63.48 12.09,74.32 12.09,75.03 JP7.9
SRIO2  (via drill 0.35)
  Top 0.152: v25.25,66.5 30.94,60.81 30.94,59.92 IC1.9
  Bottom 0.152: v25.25,66.5 23.47,66.5 22.4,65.43 21.69,65.43 15.65,71.48 15.65,73.79 14.4,75.03 JP7.11
SRIO3
  Top 0.152: IC1.10 31.65,59.74 31.65,59.03 30.4,57.78 24.18,57.78 21.34,60.63 21.34,67.39 17.25,71.48 17.25,75.03 JP7.13
SRIO4  (via drill 0.35)
  Top 0.152: v21.51,73.08 21.51,72.9 24.36,70.05 24.54,70.05 34.14,60.45 34.14,59.92 IC1.13
  Bottom 0.152: v21.51,73.08 19.56,75.03 JP7.15
SRIO5  (via drill 0.35)
  Top 0.152: v25.78,69.88 34.85,60.81 34.85,59.92 IC1.14
  Bottom 0.152: v25.78,69.88 25.78,70.76 22.23,74.32 22.23,75.03 JP7.17
SRIO6  (via drill 0.35)
  Top 0.152: v31.47,65.96 35.74,61.7 35.74,59.92 IC1.15
  Bottom 0.152: v31.47,65.96 25.96,71.48 25.96,73.79 24.71,75.03 JP7.19
SRIO7  (via drill 0.35)
  Top 0.152: v36.45,64.72 36.45,59.92 IC1.16
  Bottom 0.152: v36.45,64.72 28.09,73.08 28.09,73.61 27.38,74.32 27.38,75.03 JP7.21
SRIO8  (via drill 0.35)
  Top 0.152: v36.98,72.54 36.63,72.19 36.63,71.3 IC1.29
  Bottom 0.152: v36.98,72.54 36.98,70.05 37.34,69.7 37.34,68.99 36.98,68.63 36.09,68.63 29.69,75.03 JP7.23
SRIO9  (via drill 0.35)
  Top 0.152: v33.6,69.7 34.85,69.7 35.74,70.59 35.74,71.12 IC1.30 | v28.63,74.14 28.63,75.56 29.34,76.28 31.11,76.28 32.18,75.21 JP7.25
  Bottom 0.152: v33.6,69.7 30.05,73.25 28.98,73.25 28.63,73.61 v28.63,74.14
SRIO10
  Top 0.152: IC1.31 35.03,71.3 35.03,75.03 JP7.27
SRIO11
  Top 0.152: IC1.32 34.14,71.3 34.14,74.32 33.78,74.68 33.78,75.56 34.49,76.28 36.27,76.28 37.34,75.21 JP7.29
SRIO12  (via drill 0.35)
  Top 0.152: v36.8,67.92 33.25,67.92 31.83,69.34 31.83,71.12 IC1.35
  Bottom 0.152: v36.8,67.92 38.94,70.05 38.94,73.43 39.83,74.32 39.83,75.03 JP7.31
SRIO13  (via drill 0.35)
  Top 0.152: v37.87,67.92 37.16,67.21 33.43,67.21 31.11,69.52 31.11,71.12 IC1.36 | v41.25,72.72 41.25,73.97 42.32,75.03 JP7.33
  Bottom 0.152: v37.87,67.92 37.87,68.45 39.47,70.05 39.47,70.94 v41.25,72.72
SRIO14
  Top 0.152: IC1.37 30.23,71.12 30.23,69.88 33.25,66.85 44.63,66.85 46.05,68.28 46.05,74.14 45.16,75.03 JP7.35
SRIO15  (via drill 0.35)
  Top 0.152: v41.25,66.14 33.43,66.14 29.52,70.05 29.52,71.12 IC1.38
  Bottom 0.152: v41.25,66.14 41.25,68.45 47.47,74.68 47.47,75.03 JP7.37
SROE
  Top 0.152: JP9.2 58.14,63.12 58.14,64.19 56.72,65.61 56.72,69.56 55.3,70.99 55.3,75.03 JP7.43
SRUB
  Bottom 0.152: JP9.1 58.14,65.61 57.61,66.14 57.61,66.32 51.21,72.72 51.21,73.79 49.96,75.03 JP7.39
SRVDD
  Top 0.152: 54.76,76.28 54.05,75.56 54.05,74.68 54.41,74.32 54.41,69.7 R4.1 | 54.76,76.28 55.65,76.28 56.54,75.39 56.54,70.95 57.95,69.54 R14.1 | 33.6,78.05 34.31,78.77 53.16,78.77 54.05,77.88 54.05,76.99 54.76,76.28 | 33.6,78.05 33.43,77.88 33.43,74.48 C2.1 32.45,73.4 33.4,72.45 IC1.33 | IC1.11 32.72,59.74 32.72,57.96 C1.1 32.54,57.78 30.94,57.78 30.58,57.43 24.03,57.43 20.32,61.14 20.32,62.76 9.42,73.66 6.35,73.66 5.65,74.36 5.65,76.4 JP7.4 5.47,78.77 32.89,78.77 33.6,78.05
SRWE
  Top 0.152: IC1.17 37.52,59.92 37.52,62.41 40.18,65.08 47.3,65.08 53.34,71.12 53.34,74.5 52.81,75.03 JP7.41
TRIG
  Top 0.152: R6.1 16,29.34 16,31.11 16.54,31.65 16.54,33.96 Q4.3 16.54,34.14 16.54,35.03 11.91,39.65 11.91,41.78 11.38,42.32 11.38,43.2 12.09,43.92 31.83,43.92 32.18,44.27 33.25,44.27 35.38,42.14 SR04_0.2
  Bottom 0.152: SR04_1.2 40.89,35.38 39.65,35.38 36.45,38.58 36.45,40.01 35.38,41.07 35.38,41.96 SR04_0.2
TRIGOUT
  Top 0.152: J3.14 12.45,45.34 JP6.4
TX32LAT  (via drill 0.35)
  Top 0.152: JP4.2 77.17,54.23 77.17,38.35 JP5.12 86.94,28.63 84.28,31.29 79.12,26.14 76.36,26.14 v71.92,21.69
  Bottom 0.152: v71.92,21.69 65.96,15.73 65.96,10.85 64.54,9.42 63.12,9.42 62.94,9.25 62.59,9.25 61.7,10.13 61.7,10.49 J7.5
TXD3RD
  Top 0.152: ESP01_3.1 4.45,62.59 4.45,61.7 6.76,59.38 J6.6
URXD
  Top 0.152: ESP01_0.8 49.61,35.56 48.54,35.56 47.3,36.8 46.76,36.8 43.2,40.36 43.2,40.89 38.05,46.05 23.11,46.05 21.51,47.65 21.51,48.72 22.23,49.43 24,49.43 25.07,48.36 J3.4
UTXD
  Top 0.152: ESP01_0.1 47.12,43.03 42.14,43.03 38.41,46.76 29.16,46.76 27.74,48.18 J3.2
VCC  (via drill 0.35)
  Top 0.152: J1.4 16.19,10.48 DHT11.1 16.18,11.91 4.09,11.91 2.31,10.13 JP2.4 2.37,10 2.75,10.38 2.75,32.23 3.79,33.27 OLED.2 6.6,33.27 8.89,35.56 11.02,35.56 12.45,36.98 | Q2.1 25.78,32.18 25.78,36.09 26.14,36.45 R10.1 26.14,36.63 25.43,37.34 21.87,37.34 21.34,36.8 21.34,36.63 R11.1 21.16,36.63 20.09,36.63 v15.65,41.07 | v12.62,40.01 16,36.63 R12.1 | 12.45,36.98 10.13,39.29 JP8.1 | 12.45,36.98 15.65,33.78 15.65,32.18 Q4.1 15.65,32 15.29,31.65 15.29,28.8 15.47,28.63 19.2,28.63 19.91,29.34 | 19.91,29.34 20.62,30.05 20.62,32 Q3.1 | 19.91,29.34 20.98,28.27 38.94,28.27 46.05,35.38 47.12,35.38 ESP01_0.7
  Bottom 0.152: v15.65,41.07 14.58,40.01 v12.62,40.01 12.45,40.01 11.73,39.29 10.13,39.29 JP8.1 10.76,39.43 10.83,39.5 10.83,43.17 9.97,44.03 9.71,44.03 8.42,45.32 8.42,51.27 7.79,51.91 6.89,51.91 6.04,51.06 6.04,36.55 6.35,36.24 6.35,34.31 5.31,33.27 OLED.2 | J1.3 J1.4
VCC2ND
  Top 0.152: R3.2 R5.2 80.49,5.62 79.43,4.57 77.12,4.57 ESP01_1.7
VCC3RD
  Top 0.152: ESP01_3.7 12.09,62.76 12.09,63.83 13.16,64.9 13.16,65.61 12.09,66.67 4.27,66.67 1.96,64.36 1.96,59.38 J6.2
VCCLAT  (via drill 0.35)
  Top 0.152: 62.59,16.54 JP14.2 | 62.59,16.54 61.7,15.65 J7.1 | JP13.1 83.39,68.36 79.57,64.54 79.57,62.5 78.94,61.87 78.94,39.65 v79.48,39.12 | 62.59,16.54 63.48,15.65 64.01,15.65 J7.2
  Bottom 0.152: JP14.2 62.59,26.67 67.03,26.67 70.76,30.4 ESP01_2.7 70.94,30.58 v79.48,39.12

### Text on the board
tPlace: 2020-07 | UB: 10 DIS, 01 FPGA / OE: 10:DIS, 01 FPGA / C1: 1: ENA, 0: DIS | Esp32 to Lattice / ________________ / LSPICK: 10 ESP32 SPI CK, 01: RX / LSPIMI: 10: ESP32 MI, 01:TX | 3D IRQ / TRIGG Proxi / ECHO Proxi / IR Rx | by Edge30 | 3.3V Source / ============== / 1: LATTICE/PMOD / 0: ESP32 USB / (*** CAREFULLY SELECT ***) | VCC | by Edge30 | GND | Navili_CRZ1
bPlace: by Edge30 | Navili_MJ1 | Navili_ESP1